# Altium schematic sheet nfc-epd-mcu.SchDoc
size Letter
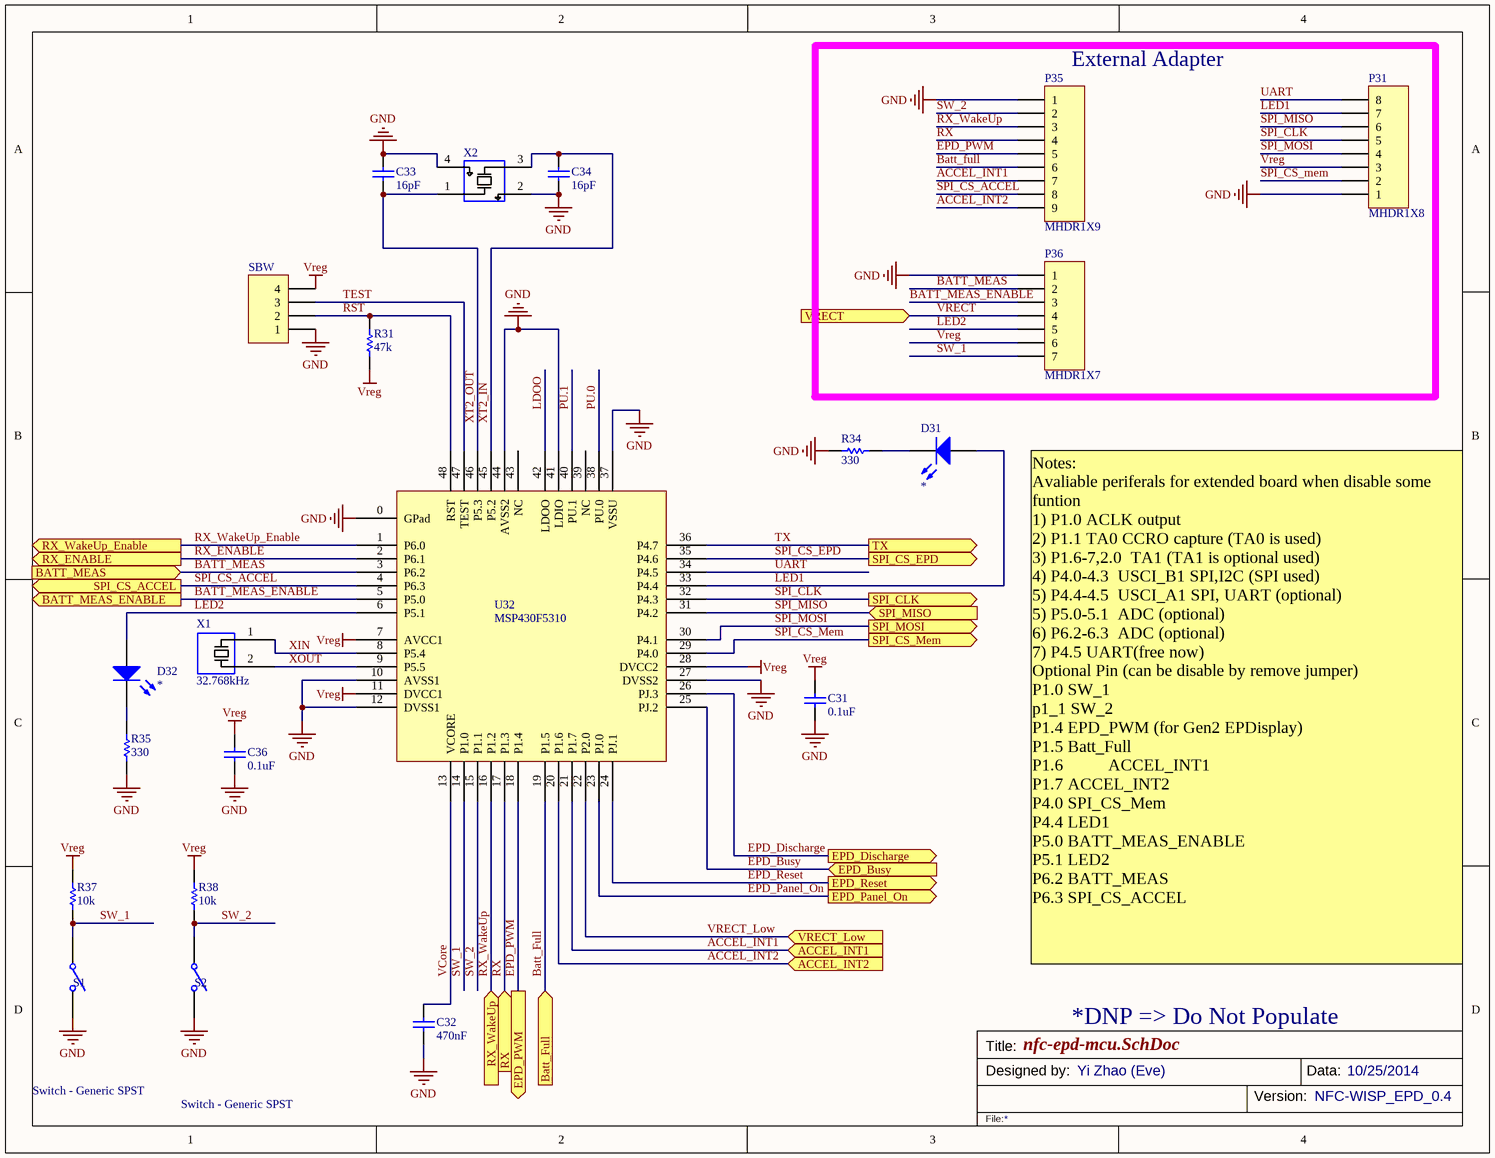
[diagram p0: nfc-epd-mcu.SchDoc]

## Parts
C31  value 0.1uF  [0603]  (hidden comment: Cap)
C32  value 470nF  [0603]  (hidden comment: Cap)
C33  value 16pF  [0603]  (hidden comment: Cap)
C34  value 16pF  [0603]  (hidden comment: Cap)
C36  value 0.1uF  [0402]  (hidden comment: Cap)
D31  LED  [Diode - 0603]  (value not drawn)
D32  LED  [Diode - 0603]  (value not drawn)
P31  MHDR1X8  [MHDR1X8]
P35  MHDR1X9  [MHDR1X9]
P36  MHDR1X7  [MHDR1X7]
R31  value 47k  [0603]  (hidden comment: Res)
R34  value 330  [0603]  (hidden comment: Res)
R35  value 330  [0603]  (hidden comment: Res)
R37  value 10k  [0603]  (hidden comment: Res)
R38  value 10k  [0603]  (hidden comment: Res)
S1  Switch - Generic SPST  [Switch - B3U-1000P]
S2  Switch - Generic SPST  [Switch - B3U-1000P]
SBW  MHDR1X4  [MHDR1X4]  (value not drawn)
U32  MSP430F5310  [48-QFN]
X1  value 32.768kHz  [XTAL - 2Pin [3.2mm x 1.5mm]]  (hidden comment: XTAL)
X2  XTAL 4pin  [XTAL - 4Pin [3.2MM X 2.5MM]]  (value not drawn)

## Blocks framed on the sheet
External Adapter: P31 P35 P36

## Ports
ACCEL_INT1 (in), ACCEL_INT2 (in), Batt_Full (in), BATT_MEAS (in), BATT_MEAS_ENABLE (out), EPD_Busy (in), EPD_Discharge (out), EPD_Panel_On (out), EPD_PWM (out), EPD_Reset (out), RX (in), RX_ENABLE (out), RX_WakeUp (in), RX_WakeUp_Enable (out), SPI_CLK (out), SPI_CS_ACCEL (out), SPI_CS_EPD (out), SPI_CS_Mem (out), SPI_MISO (in), SPI_MOSI (out), TX (out), VRECT (in), VRECT_Low (in)

## Nets
GND: C31.1 C32.2 C33.2 C34.1 C36.1 P31.1 P35.1 P36.1 R34.1 R35.1 S1.2(NO) S2.2(NO) SBW.1 U32.0(GPad) U32.10(AVSS1) U32.12(DVSS1) U32.27(DVSS2) U32.37(VSSU) U32.41(LDIO) U32.44(AVSS2) X2.2(Gnd) X2.4(Gnd)
Vreg: C31.2 C36.2 P31.3 P36.6 R31.2 R37.2 R38.2 SBW.4 U32.7(AVCC1) U32.11(DVCC1) U32.28(DVCC2)
ACCEL_INT1: P35.7 U32.21(P1.7) ; port ACCEL_INT1
ACCEL_INT2: P35.9 U32.20(P1.6) ; port ACCEL_INT2
Batt_Full: P35.6 U32.19(P1.5) ; port Batt_Full
BATT_MEAS: P36.2 U32.3(P6.2) ; port BATT_MEAS
BATT_MEAS_ENABLE: P36.3 U32.5(P5.0) ; port BATT_MEAS_ENABLE
EPD_Busy: U32.25(PJ.2) ; port EPD_Busy
EPD_Discharge: U32.26(PJ.3) ; port EPD_Discharge
EPD_Panel_On: U32.23(PJ.0) ; port EPD_Panel_On
EPD_PWM: P35.5 U32.18(P1.4) ; port EPD_PWM
EPD_Reset: U32.24(PJ.1) ; port EPD_Reset
LDOO: U32.42(LDOO)
LED1: D31.1(A) P31.7 U32.33(P4.4)
LED2: D32.1(A) P36.5 U32.6(P5.1)
PU.0: U32.38(PU.0)
PU.1: U32.40(PU.1)
RST: R31.1 SBW.2 U32.48(RST)
RX: P35.4 U32.17(P1.3) ; port RX
RX_ENABLE: U32.2(P6.1) ; port RX_ENABLE
RX_WakeUp: P35.3 U32.16(P1.2) ; port RX_WakeUp
RX_WakeUp_Enable: U32.1(P6.0) ; port RX_WakeUp_Enable
SPI_CLK: P31.5 U32.32(P4.3) ; port SPI_CLK
SPI_CS_ACCEL: P35.8 U32.4(P6.3) ; port SPI_CS_ACCEL
SPI_CS_EPD: U32.35(P4.6) ; port SPI_CS_EPD
SPI_CS_Mem: P31.2 U32.29(P4.0) ; port SPI_CS_Mem
SPI_MISO: P31.6 U32.31(P4.2) ; port SPI_MISO
SPI_MOSI: P31.4 U32.30(P4.1) ; port SPI_MOSI
SW_1: P36.7 R37.1 S1.1(COMMON) U32.14(P1.0)
SW_2: P35.2 R38.1 S2.1(COMMON) U32.15(P1.1)
TEST: SBW.3 U32.47(TEST)
TX: U32.36(P4.7) ; port TX
UART: P31.8 U32.34(P4.5)
VCore: C32.1 U32.13(VCORE)
VRECT: P36.4 ; port VRECT
VRECT_Low: U32.22(P2.0) ; port VRECT_Low
XIN: U32.8(P5.4) X1.1
XOUT: U32.9(P5.5) X1.2
XT2_IN: C34.2 U32.45(P5.2) X2.3(XOUT)
XT2_OUT: C33.1 U32.46(P5.3) X2.1(XIN)
NetD31_2: D31.2(K) R34.2
NetD32_2: D32.2(K) R35.2

Not connected (* = marked no-connect by the designer): U32 39(NC) 43(NC)

## Notes on the sheet
- Notes:
  Avaliable periferals for extended board when disable some funtion
  1) P1.0	ACLK output
  2) P1.1	TA0 CCRO capture (TA0 is used)
  3) P1.6-7,2.0  TA1 (TA1 is optional used)
  4) P4.0-4.3	 USCI_B1 SPI,I2C (SPI used)
  5) P4.4-4.5  USCI_A1 SPI, UART (optional)
  5) P5.0-5.1  ADC (optional)
  6) P6.2-6.3  ADC (optional)
  7) P4.5	UART(free now)
  Optional Pin (can be disable by remove jumper)
  P1.0	SW_1
  p1_1	SW_2
  P1.4	EPD_PWM (for Gen2 EPDisplay)
  P1.5	Batt_Full
  P1.6          ACCEL_INT1
  P1.7	ACCEL_INT2
  P4.0	SPI_CS_Mem
  P4.4	LED1
  P5.0	BATT_MEAS_ENABLE
  P5.1	LED2
  P6.2	BATT_MEAS
  P6.3	SPI_CS_ACCEL
- *DNP => Do Not Populate
- Title:
- Designed by:
- Yi Zhao (Eve)
- Version:
- Data:
- NFC-WISP_EPD_0.4
- 10/25/2014
- File:

## Library data of the parts
C31-C34 C36 = Cap: Ceramic Capacitor (Surface Mount); Manufacturer: Generic Ceramic Chip Cap (TBD); Digi-Key Part Number: *; Manufacturer Part Number: *; Note: *; Rating: *
D31 D32 = Diode - LED: Typical RED, GREEN, YELLOW, AMBER GaAs LED; Digi-Key Part Number: *; Manufacturer: *; Manufacturer Part Number: *; Note: *; Value: *; Rating: *
P31 = MHDR1X8: Header, 8-Pin; Manufacturer Part Number 1: 0603ZD105KAT2A; Note: DNP; LatestRevisionDate: 17-Jul-2002; LatestRevisionNote: Re-released for DXP Platform.; Publisher: Altium Limited
P35 = MHDR1X9: Header, 9-Pin; Note: DNP; LatestRevisionDate: 17-Jul-2002; LatestRevisionNote: Re-released for DXP Platform.; Publisher: Altium Limited
P36 = MHDR1X7: Header, 7-Pin; Note: DNP; LatestRevisionDate: 17-Jul-2002; LatestRevisionNote: Re-released for DXP Platform.; Publisher: Altium Limited
R31 R34 R35 R37 R38 = Res: Chip Resistor (Surface Mount); Manufacturer: Generic Chip Res (TBD); Manufacturer Part Number: *; Digi-Key Part Number: *; Rating: *; Note: *
S1 S2 = Switch - Generic SPST: Generic Single-Pole, Single-Throw Switch; Manufacturer: *; Digi-Key Part Number: *; Manufacturer Part Number: *; Note: *; Value: *; Rating: *; Supplier 1: Digi-Key; Supplier Part Number 1: SW1143CT-ND
SBW = MHDR1X4: Header, 4-Pin; LatestRevisionDate: 17-Jul-2002; LatestRevisionNote: Re-released for DXP Platform.; Publisher: Altium Limited
U32 = MSP430F5310 - 48Pin: MSP430 - 48LQFP or 48QFN; Manufacturer: Texas Instruments; Manufacturer Part Number: MSP430F5310IRGZ; Digi-Key Part Number: 296-28193-2-ND or 296-28133-1-ND; Rating: *; Value: *; Note: *; Supplier 1: Digi-Key; Supplier Part Number 1: 296-28133-1-ND
X1 = XTAL 2-pins: Crystal - 2-Pin Surface Mount; Manufacturer: Epson Toyocom Corporation; Manufacturer Part Number: FC-135 32.7680KA-A3; Digi-Key Part Number: example: SE2413CT-ND
X2 = XTAL 4-pins: Crystal - 4-Pin Surface Mount; Manufacturer Part Number 1: ABM8G-13.560MHZ-B4Y-T; Note: double check foot print; Rating: *; Value: *; Supplier 1: Digi-Key; Supplier Part Number 1: 535-10286-1-ND